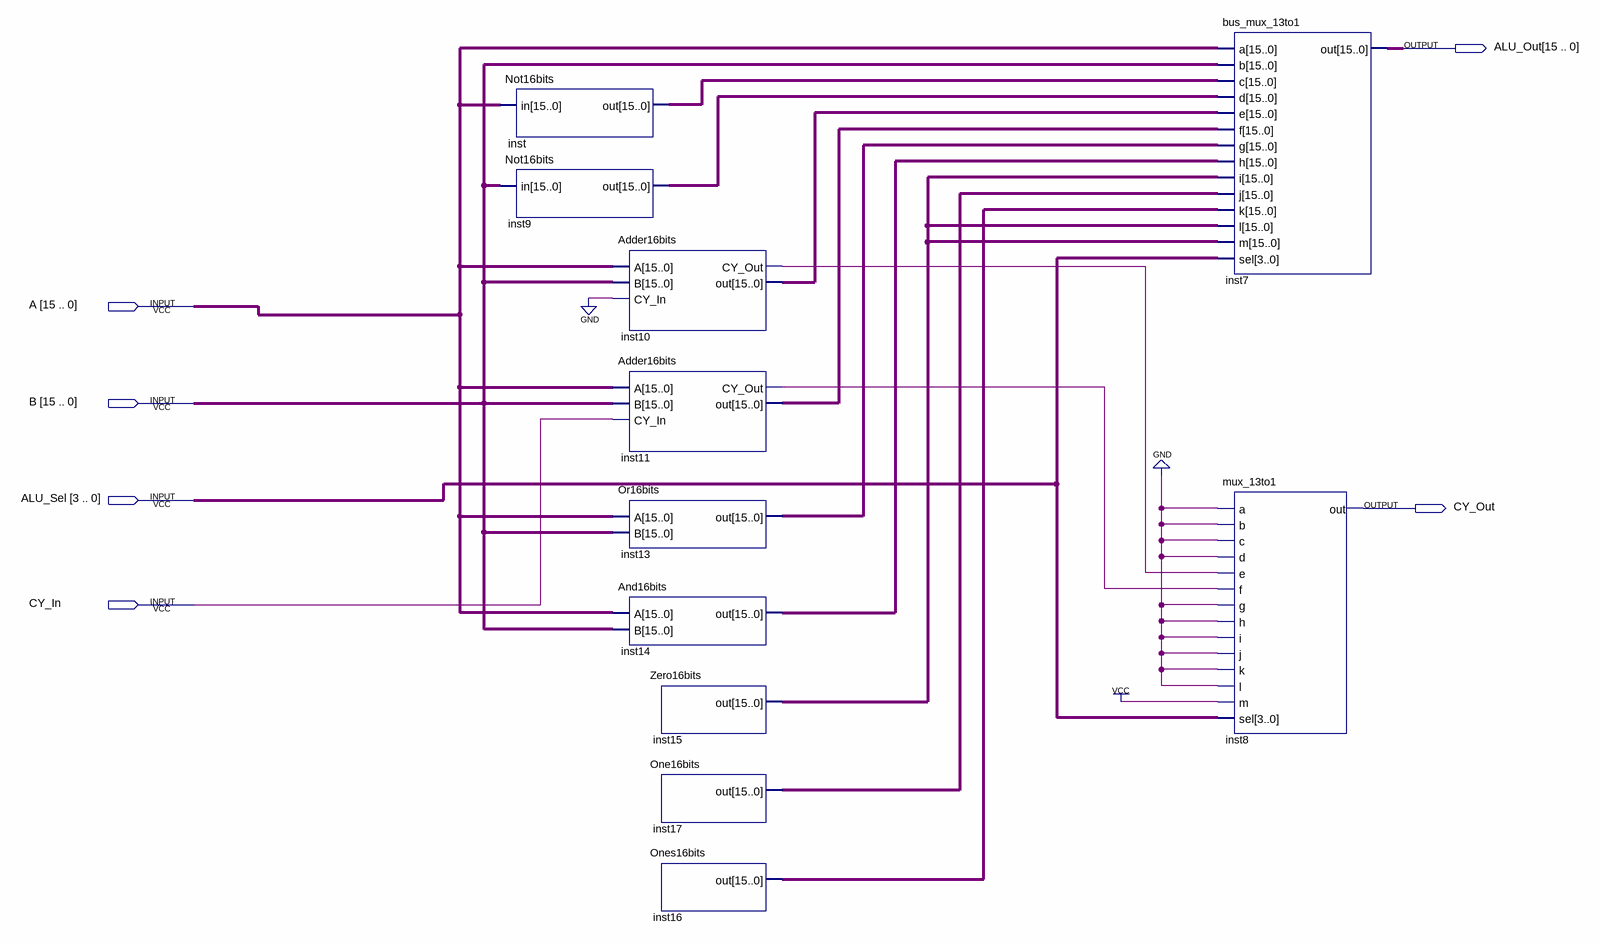
[diagram p0: schematic sheet]
// Quartus schematic ALU_Block.bdf as structural Verilog: 11 symbols, 6 pins
module ALU_Block (
  input  [15:0] A,
  input  [15:0] B,
  input  [3:0] ALU_Sel,
  input  CY_In,
  output [15:0] ALU_Out,
  output CY_Out
);

  wire inst10_cy_out, inst11_cy_out;
  wire [15:0] inst9_out, inst10_out, inst11_out, inst13_out, inst14_out, inst15_out, inst16_out, inst17_out,
       inst_out;

  Not16bits inst (.in(A), .out(inst_out));
  Not16bits inst9 (.in(B), .out(inst9_out));
  Adder16bits inst10 (.A(A), .B(B), .CY_In(1'b0), .CY_Out(inst10_cy_out), .out(inst10_out));
  Adder16bits inst11 (.A(A), .B(B), .CY_In(CY_In), .CY_Out(inst11_cy_out), .out(inst11_out));
  Or16bits inst13 (.A(A), .B(B), .out(inst13_out));
  And16bits inst14 (.A(A), .B(B), .out(inst14_out));
  Zero16bits inst15 (.out(inst15_out));
  One16bits inst17 (.out(inst17_out));
  Ones16bits inst16 (.out(inst16_out));
  bus_mux_13to1 inst7 (
    .a(A), .b(B), .c(inst_out), .d(inst9_out), .e(inst10_out), .f(inst11_out), .g(inst13_out),
    .h(inst14_out), .i(inst15_out), .j(inst17_out), .k(inst16_out), .l(inst15_out), .m(inst15_out),
    .sel(ALU_Sel), .out(ALU_Out));
  mux_13to1 inst8 (
    .a(1'b0), .b(1'b0), .c(1'b0), .d(1'b0), .e(inst10_cy_out), .f(inst11_cy_out), .g(1'b0), .h(1'b0),
    .i(1'b0), .j(1'b0), .k(1'b0), .l(1'b0), .m(1'b1), .sel(ALU_Sel), .out(CY_Out));
endmodule
